# EAGLE design improved sample-and-hold (EAGLE 7.2.0)
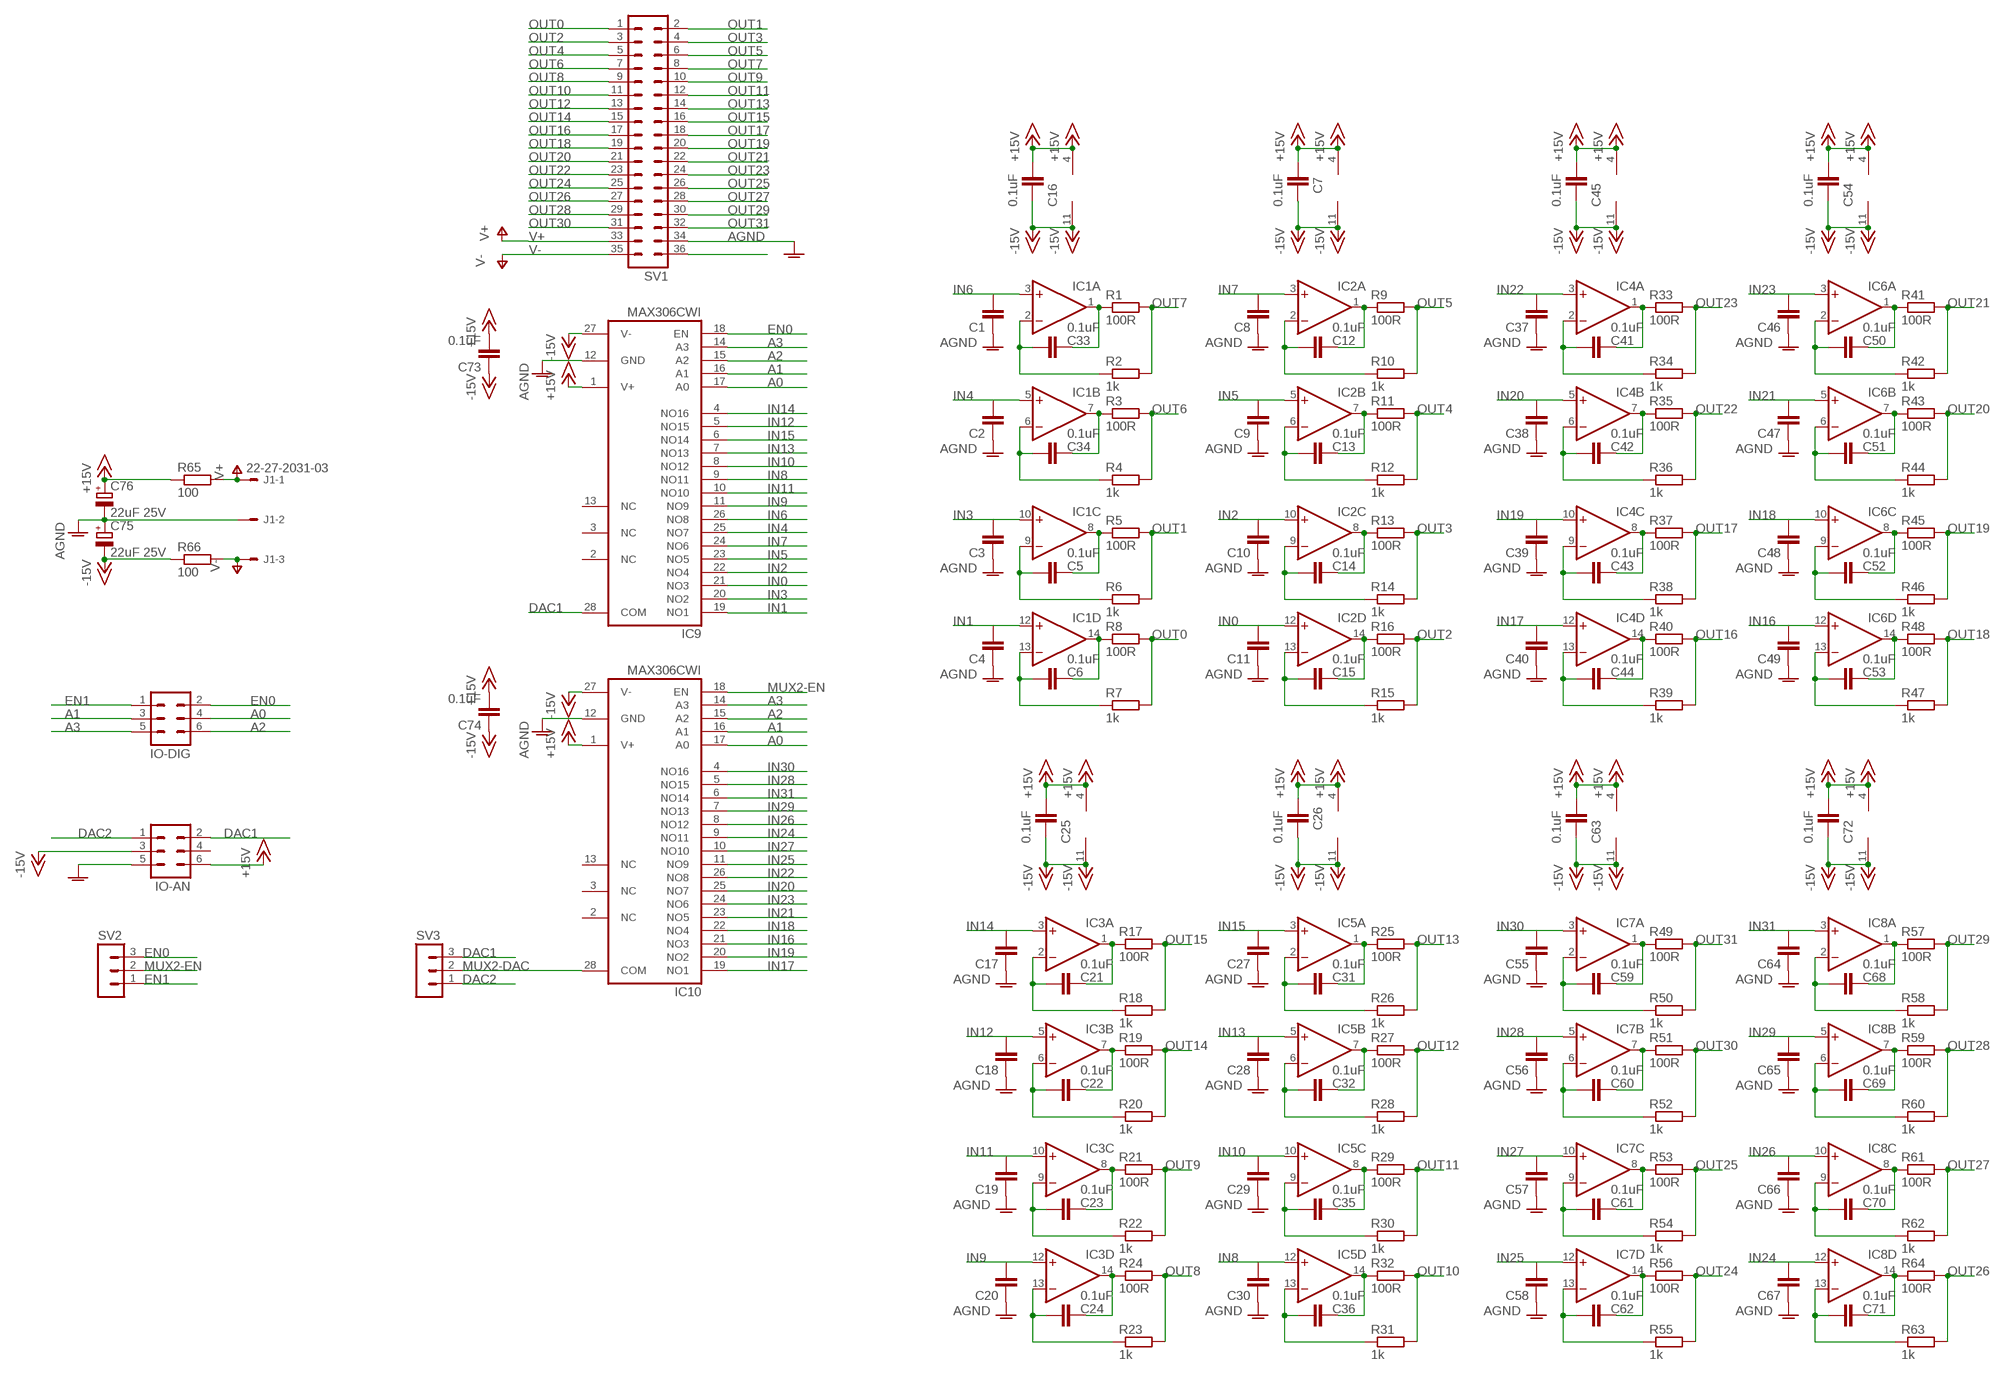
[diagram p0: schematic, sheet 1]

## Parts
C1  C-EUC1206  [C1206]
C2  C-EUC1206  [C1206]
C3  C-EUC1206  [C1206]
C4  C-EUC1206  [C1206]
C5  0.1uF  C-EUC0603  [C0603]
C6  0.1uF  C-EUC0603  [C0603]
C7  0.1uF  C-EUC0603  [C0603]
C8  C-EUC1206  [C1206]
C9  C-EUC1206  [C1206]
C10  C-EUC1206  [C1206]
C11  C-EUC1206  [C1206]
C12  0.1uF  C-EUC0603  [C0603]
C13  0.1uF  C-EUC0603  [C0603]
C14  0.1uF  C-EUC0603  [C0603]
C15  0.1uF  C-EUC0603  [C0603]
C16  0.1uF  C-EUC0603  [C0603]
C17  C-EUC1206  [C1206]
C18  C-EUC1206  [C1206]
C19  C-EUC1206  [C1206]
C20  C-EUC1206  [C1206]
C21  0.1uF  C-EUC0603  [C0603]
C22  0.1uF  C-EUC0603  [C0603]
C23  0.1uF  C-EUC0603  [C0603]
C24  0.1uF  C-EUC0603  [C0603]
C25  0.1uF  C-EUC0603  [C0603]
C26  0.1uF  C-EUC0603  [C0603]
C27  C-EUC1206  [C1206]
C28  C-EUC1206  [C1206]
C29  C-EUC1206  [C1206]
C30  C-EUC1206  [C1206]
C31  0.1uF  C-EUC0603  [C0603]
C32  0.1uF  C-EUC0603  [C0603]
C33  0.1uF  C-EUC0603  [C0603]
C34  0.1uF  C-EUC0603  [C0603]
C35  0.1uF  C-EUC0603  [C0603]
C36  0.1uF  C-EUC0603  [C0603]
C37  C-EUC1206  [C1206]
C38  C-EUC1206  [C1206]
C39  C-EUC1206  [C1206]
C40  C-EUC1206  [C1206]
C41  0.1uF  C-EUC0603  [C0603]
C42  0.1uF  C-EUC0603  [C0603]
C43  0.1uF  C-EUC0603  [C0603]
C44  0.1uF  C-EUC0603  [C0603]
C45  0.1uF  C-EUC0603  [C0603]
C46  C-EUC1206  [C1206]
C47  C-EUC1206  [C1206]
C48  C-EUC1206  [C1206]
C49  C-EUC1206  [C1206]
C50  0.1uF  C-EUC0603  [C0603]
C51  0.1uF  C-EUC0603  [C0603]
C52  0.1uF  C-EUC0603  [C0603]
C53  0.1uF  C-EUC0603  [C0603]
C54  0.1uF  C-EUC0603  [C0603]
C55  C-EUC1206  [C1206]
C56  C-EUC1206  [C1206]
C57  C-EUC1206  [C1206]
C58  C-EUC1206  [C1206]
C59  0.1uF  C-EUC0603  [C0603]
C60  0.1uF  C-EUC0603  [C0603]
C61  0.1uF  C-EUC0603  [C0603]
C62  0.1uF  C-EUC0603  [C0603]
C63  0.1uF  C-EUC0603  [C0603]
C64  C-EUC1206  [C1206]
C65  C-EUC1206  [C1206]
C66  C-EUC1206  [C1206]
C67  C-EUC1206  [C1206]
C68  0.1uF  C-EUC0603  [C0603]
C69  0.1uF  C-EUC0603  [C0603]
C70  0.1uF  C-EUC0603  [C0603]
C71  0.1uF  C-EUC0603  [C0603]
C72  0.1uF  C-EUC0603  [C0603]
C73  0.1uF  C-EUC0603  [C0603]
C74  0.1uF  C-EUC0603  [C0603]
C75  22uF 25V  CPOL-EUE2-5  [E2-5]
C76  22uF 25V  CPOL-EUE2-5  [E2-5]
IC1  TL074D  [SO14]
IC2  TL074D  [SO14]
IC3  TL074D  [SO14]
IC4  TL074D  [SO14]
IC5  TL074D  [SO14]
IC6  TL074D  [SO14]
IC7  TL074D  [SO14]
IC8  TL074D  [SO14]
IC9  MAX306CWI  [SO28L]
IC10  MAX306CWI  [SO28L]
IO-AN  MA03-2  [MA03-2]
IO-DIG  MA03-2  [MA03-2]
J1  22-27-2031-03  [6410-03]
R1  100R  R-EU_R0603  [R0603]
R2  1k  R-EU_R0603  [R0603]
R3  100R  R-EU_R0603  [R0603]
R4  1k  R-EU_R0603  [R0603]
R5  100R  R-EU_R0603  [R0603]
R6  1k  R-EU_R0603  [R0603]
R7  1k  R-EU_R0603  [R0603]
R8  100R  R-EU_R0603  [R0603]
R9  100R  R-EU_R0603  [R0603]
R10  1k  R-EU_R0603  [R0603]
R11  100R  R-EU_R0603  [R0603]
R12  1k  R-EU_R0603  [R0603]
R13  100R  R-EU_R0603  [R0603]
R14  1k  R-EU_R0603  [R0603]
R15  1k  R-EU_R0603  [R0603]
R16  100R  R-EU_R0603  [R0603]
R17  100R  R-EU_R0603  [R0603]
R18  1k  R-EU_R0603  [R0603]
R19  100R  R-EU_R0603  [R0603]
R20  1k  R-EU_R0603  [R0603]
R21  100R  R-EU_R0603  [R0603]
R22  1k  R-EU_R0603  [R0603]
R23  1k  R-EU_R0603  [R0603]
R24  100R  R-EU_R0603  [R0603]
R25  100R  R-EU_R0603  [R0603]
R26  1k  R-EU_R0603  [R0603]
R27  100R  R-EU_R0603  [R0603]
R28  1k  R-EU_R0603  [R0603]
R29  100R  R-EU_R0603  [R0603]
R30  1k  R-EU_R0603  [R0603]
R31  1k  R-EU_R0603  [R0603]
R32  100R  R-EU_R0603  [R0603]
R33  100R  R-EU_R0603  [R0603]
R34  1k  R-EU_R0603  [R0603]
R35  100R  R-EU_R0603  [R0603]
R36  1k  R-EU_R0603  [R0603]
R37  100R  R-EU_R0603  [R0603]
R38  1k  R-EU_R0603  [R0603]
R39  1k  R-EU_R0603  [R0603]
R40  100R  R-EU_R0603  [R0603]
R41  100R  R-EU_R0603  [R0603]
R42  1k  R-EU_R0603  [R0603]
R43  100R  R-EU_R0603  [R0603]
R44  1k  R-EU_R0603  [R0603]
R45  100R  R-EU_R0603  [R0603]
R46  1k  R-EU_R0603  [R0603]
R47  1k  R-EU_R0603  [R0603]
R48  100R  R-EU_R0603  [R0603]
R49  100R  R-EU_R0603  [R0603]
R50  1k  R-EU_R0603  [R0603]
R51  100R  R-EU_R0603  [R0603]
R52  1k  R-EU_R0603  [R0603]
R53  100R  R-EU_R0603  [R0603]
R54  1k  R-EU_R0603  [R0603]
R55  1k  R-EU_R0603  [R0603]
R56  100R  R-EU_R0603  [R0603]
R57  100R  R-EU_R0603  [R0603]
R58  1k  R-EU_R0603  [R0603]
R59  100R  R-EU_R0603  [R0603]
R60  1k  R-EU_R0603  [R0603]
R61  100R  R-EU_R0603  [R0603]
R62  1k  R-EU_R0603  [R0603]
R63  1k  R-EU_R0603  [R0603]
R64  100R  R-EU_R0603  [R0603]
R65  100  R-EU_0207/7  [0207/7]
R66  100  R-EU_0207/7  [0207/7]
SV1  MA18-2  [MA18-2]
SV2  MA03-1  [MA03-1]
SV3  MA03-1  [MA03-1]

## Nets
+15V: C7.1 C16.1 C25.1 C26.1 C45.1 C54.1 C63.1 C72.1 C73.2 C74.2 C76.+ IC1.4(P:V+) IC2.4(P:V+) IC3.4(P:V+) IC4.4(P:V+) IC5.4(P:V+) IC6.4(P:V+) IC7.4(P:V+) IC8.4(P:V+) IC9.1(V+) IC10.1(V+) IO-AN.6 R65.1
-15V: C7.2 C16.2 C25.2 C26.2 C45.2 C54.2 C63.2 C72.2 C73.1 C74.1 C75.- IC1.11(P:V-) IC2.11(P:V-) IC3.11(P:V-) IC4.11(P:V-) IC5.11(P:V-) IC6.11(P:V-) IC7.11(P:V-) IC8.11(P:V-) IC9.27(V-) IC10.27(V-) IO-AN.3 R66.1
A0: IC9.17(A0) IC10.17(A0) IO-DIG.4
A1: IC9.16(A1) IC10.16(A1) IO-DIG.3
A2: IC9.15(A2) IC10.15(A2) IO-DIG.6
A3: IC9.14(A3) IC10.14(A3) IO-DIG.5
AGND: C1.1 C2.1 C3.1 C4.1 C8.1 C9.1 C10.1 C11.1 C17.1 C18.1 C19.1 C20.1 C27.1 C28.1 C29.1 C30.1 C37.1 C38.1 C39.1 C40.1 C46.1 C47.1 C48.1 C49.1 C55.1 C56.1 C57.1 C58.1 C64.1 C65.1 C66.1 C67.1 C75.+ C76.- IC9.12(GND) IC10.12(GND) IO-AN.5 J1.2 SV1.34
DAC1: IC9.28(COM) IO-AN.2 SV3.3
DAC2: IO-AN.1 SV3.1
EN0: IC9.18(EN) IO-DIG.2 SV2.3
EN1: IO-DIG.1 SV2.1
IN0: C11.2 IC2.12(D:+IN) IC9.21(NO3)
IN1: C4.2 IC1.12(D:+IN) IC9.19(NO1)
IN2: C10.2 IC2.10(C:+IN) IC9.22(NO4)
IN3: C3.2 IC1.10(C:+IN) IC9.20(NO2)
IN4: C2.2 IC1.5(B:+IN) IC9.25(NO7)
IN5: C9.2 IC2.5(B:+IN) IC9.23(NO5)
IN6: C1.2 IC1.3(A:+IN) IC9.26(NO8)
IN7: C8.2 IC2.3(A:+IN) IC9.24(NO6)
IN8: C30.2 IC5.12(D:+IN) IC9.9(NO11)
IN9: C20.2 IC3.12(D:+IN) IC9.11(NO9)
IN10: C29.2 IC5.10(C:+IN) IC9.8(NO12)
IN11: C19.2 IC3.10(C:+IN) IC9.10(NO10)
IN12: C18.2 IC3.5(B:+IN) IC9.5(NO15)
IN13: C28.2 IC5.5(B:+IN) IC9.7(NO13)
IN14: C17.2 IC3.3(A:+IN) IC9.4(NO16)
IN15: C27.2 IC5.3(A:+IN) IC9.6(NO14)
IN16: C49.2 IC6.12(D:+IN) IC10.21(NO3)
IN17: C40.2 IC4.12(D:+IN) IC10.19(NO1)
IN18: C48.2 IC6.10(C:+IN) IC10.22(NO4)
IN19: C39.2 IC4.10(C:+IN) IC10.20(NO2)
IN20: C38.2 IC4.5(B:+IN) IC10.25(NO7)
IN21: C47.2 IC6.5(B:+IN) IC10.23(NO5)
IN22: C37.2 IC4.3(A:+IN) IC10.26(NO8)
IN23: C46.2 IC6.3(A:+IN) IC10.24(NO6)
IN24: C67.2 IC8.12(D:+IN) IC10.9(NO11)
IN25: C58.2 IC7.12(D:+IN) IC10.11(NO9)
IN26: C66.2 IC8.10(C:+IN) IC10.8(NO12)
IN27: C57.2 IC7.10(C:+IN) IC10.10(NO10)
IN28: C56.2 IC7.5(B:+IN) IC10.5(NO15)
IN29: C65.2 IC8.5(B:+IN) IC10.7(NO13)
IN30: C55.2 IC7.3(A:+IN) IC10.4(NO16)
IN31: C64.2 IC8.3(A:+IN) IC10.6(NO14)
MUX2-DAC: IC10.28(COM) SV3.2
MUX2-EN: IC10.18(EN) SV2.2
N$1: C33.2 IC1.2(A:-IN) R2.1
N$2: C33.1 IC1.1(A:OUT) R1.1
N$3: C34.1 IC1.7(B:OUT) R3.1
N$4: C5.1 IC1.8(C:OUT) R5.1
N$5: C34.2 IC1.6(B:-IN) R4.1
N$6: C6.1 IC1.14(D:OUT) R8.1
N$7: C5.2 IC1.9(C:-IN) R6.1
N$8: C6.2 IC1.13(D:-IN) R7.1
N$9: C21.1 IC3.1(A:OUT) R17.1
N$10: C21.2 IC3.2(A:-IN) R18.1
N$11: C12.1 IC2.1(A:OUT) R9.1
N$12: C12.2 IC2.2(A:-IN) R10.1
N$13: C13.1 IC2.7(B:OUT) R11.1
N$14: C13.2 IC2.6(B:-IN) R12.1
N$15: C14.1 IC2.8(C:OUT) R13.1
N$16: C15.1 IC2.14(D:OUT) R16.1
N$17: C14.2 IC2.9(C:-IN) R14.1
N$18: C15.2 IC2.13(D:-IN) R15.1
N$19: C22.1 IC3.7(B:OUT) R19.1
N$20: C22.2 IC3.6(B:-IN) R20.1
N$21: C23.1 IC3.8(C:OUT) R21.1
N$22: C24.1 IC3.14(D:OUT) R24.1
N$23: C23.2 IC3.9(C:-IN) R22.1
N$24: C24.2 IC3.13(D:-IN) R23.1
N$25: C31.1 IC5.1(A:OUT) R25.1
N$26: C31.2 IC5.2(A:-IN) R26.1
N$27: C32.1 IC5.7(B:OUT) R27.1
N$28: C32.2 IC5.6(B:-IN) R28.1
N$29: C35.1 IC5.8(C:OUT) R29.1
N$30: C36.1 IC5.14(D:OUT) R32.1
N$31: C35.2 IC5.9(C:-IN) R30.1
N$32: C36.2 IC5.13(D:-IN) R31.1
N$33: C41.1 IC4.1(A:OUT) R33.1
N$34: C41.2 IC4.2(A:-IN) R34.1
N$35: C42.1 IC4.7(B:OUT) R35.1
N$36: C42.2 IC4.6(B:-IN) R36.1
N$37: C43.1 IC4.8(C:OUT) R37.1
N$38: C44.1 IC4.14(D:OUT) R40.1
N$39: C43.2 IC4.9(C:-IN) R38.1
N$40: C44.2 IC4.13(D:-IN) R39.1
N$41: C50.1 IC6.1(A:OUT) R41.1
N$42: C50.2 IC6.2(A:-IN) R42.1
N$43: C51.1 IC6.7(B:OUT) R43.1
N$44: C51.2 IC6.6(B:-IN) R44.1
N$45: C52.1 IC6.8(C:OUT) R45.1
N$46: C53.1 IC6.14(D:OUT) R48.1
N$47: C52.2 IC6.9(C:-IN) R46.1
N$48: C53.2 IC6.13(D:-IN) R47.1
N$49: C59.1 IC7.1(A:OUT) R49.1
N$50: C59.2 IC7.2(A:-IN) R50.1
N$51: C60.1 IC7.7(B:OUT) R51.1
N$52: C60.2 IC7.6(B:-IN) R52.1
N$53: C61.1 IC7.8(C:OUT) R53.1
N$54: C62.1 IC7.14(D:OUT) R56.1
N$55: C61.2 IC7.9(C:-IN) R54.1
N$56: C62.2 IC7.13(D:-IN) R55.1
N$57: C68.1 IC8.1(A:OUT) R57.1
N$58: C68.2 IC8.2(A:-IN) R58.1
N$59: C69.1 IC8.7(B:OUT) R59.1
N$60: C69.2 IC8.6(B:-IN) R60.1
N$61: C70.1 IC8.8(C:OUT) R61.1
N$62: C71.1 IC8.14(D:OUT) R64.1
N$63: C70.2 IC8.9(C:-IN) R62.1
N$64: C71.2 IC8.13(D:-IN) R63.1
N$65: SV1.36
OUT0: R7.2 R8.2 SV1.1
OUT1: R5.2 R6.2 SV1.2
OUT2: R15.2 R16.2 SV1.3
OUT3: R13.2 R14.2 SV1.4
OUT4: R11.2 R12.2 SV1.5
OUT5: R9.2 R10.2 SV1.6
OUT6: R3.2 R4.2 SV1.7
OUT7: R1.2 R2.2 SV1.8
OUT8: R23.2 R24.2 SV1.9
OUT9: R21.2 R22.2 SV1.10
OUT10: R31.2 R32.2 SV1.11
OUT11: R29.2 R30.2 SV1.12
OUT12: R27.2 R28.2 SV1.13
OUT13: R25.2 R26.2 SV1.14
OUT14: R19.2 R20.2 SV1.15
OUT15: R17.2 R18.2 SV1.16
OUT16: R39.2 R40.2 SV1.17
OUT17: R37.2 R38.2 SV1.18
OUT18: R47.2 R48.2 SV1.19
OUT19: R45.2 R46.2 SV1.20
OUT20: R43.2 R44.2 SV1.21
OUT21: R41.2 R42.2 SV1.22
OUT22: R35.2 R36.2 SV1.23
OUT23: R33.2 R34.2 SV1.24
OUT24: R55.2 R56.2 SV1.25
OUT25: R53.2 R54.2 SV1.26
OUT26: R63.2 R64.2 SV1.27
OUT27: R61.2 R62.2 SV1.28
OUT28: R59.2 R60.2 SV1.29
OUT29: R57.2 R58.2 SV1.30
OUT30: R51.2 R52.2 SV1.31
OUT31: R49.2 R50.2 SV1.32
V+: J1.1 R65.2 SV1.33
V-: J1.3 R66.2 SV1.35
Unconnected: IC9.2(NC) IC9.3(NC) IC9.13(NC) IC10.2(NC) IC10.3(NC) IC10.13(NC) IO-AN.4

## Library data of the parts
C1-C74 = resistor:C-EU: CAPACITOR, European symbol
C75 C76 = resistor:CPOL-EU: POLARIZED CAPACITOR, European symbol
IC1-IC8 = linear:TL074: OP AMP
IC9 IC10 = maxim:MAX306CWI: MULTIPLEXER; MF: MAXIM; MPN: MAX306CWI; OC_FARNELL: unknown; OC_NEWARK: 90C2555
IO-AN IO-DIG = con-lstb:MA03-2: PIN HEADER; OC_FARNELL: unknown; OC_NEWARK: unknown
J1 = con-molex:22-?-03: CONNECTOR wire to board 2.54 mm (.1 inch) pitch header; OC_FARNELL: unknown; OC_NEWARK: unknown
R1-R66 = resistor:R-EU_: RESISTOR, European symbol
SV1 = con-lstb:MA18-2: PIN HEADER; OC_FARNELL: unknown; OC_NEWARK: unknown
SV2 SV3 = joakim:MA03-1: PIN HEADER; OC_FARNELL: unknown; OC_NEWARK: unknown

## Board
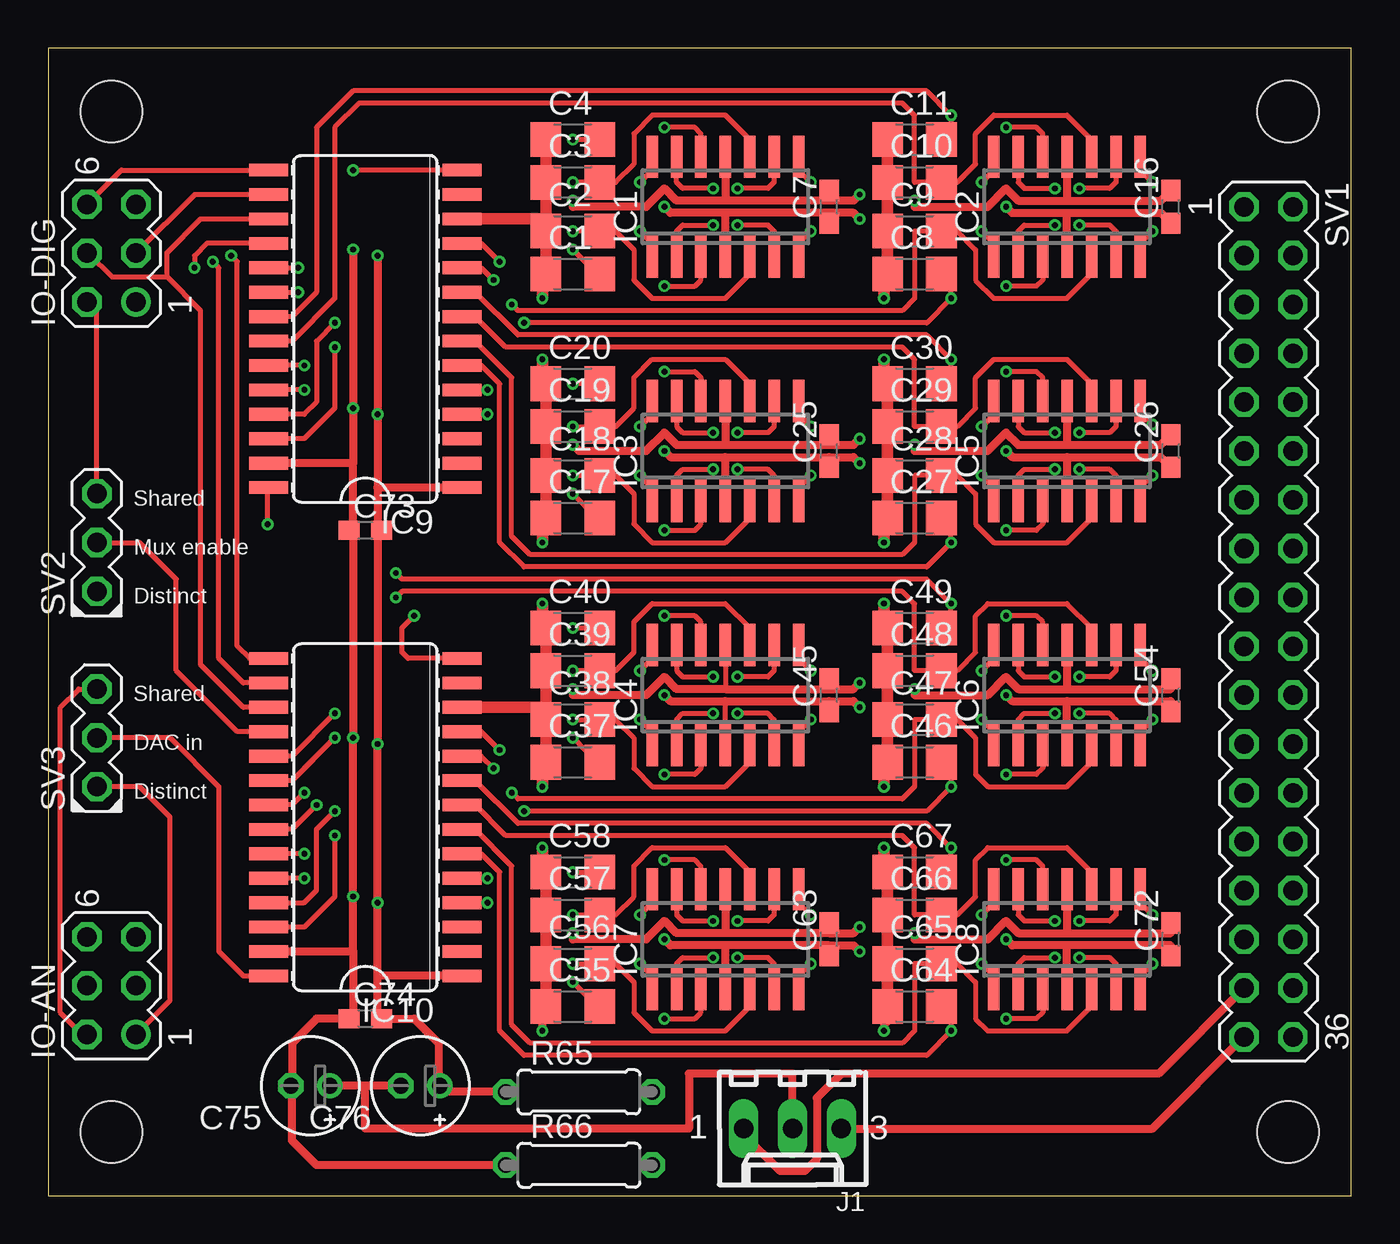
[diagram p1: board, top side]
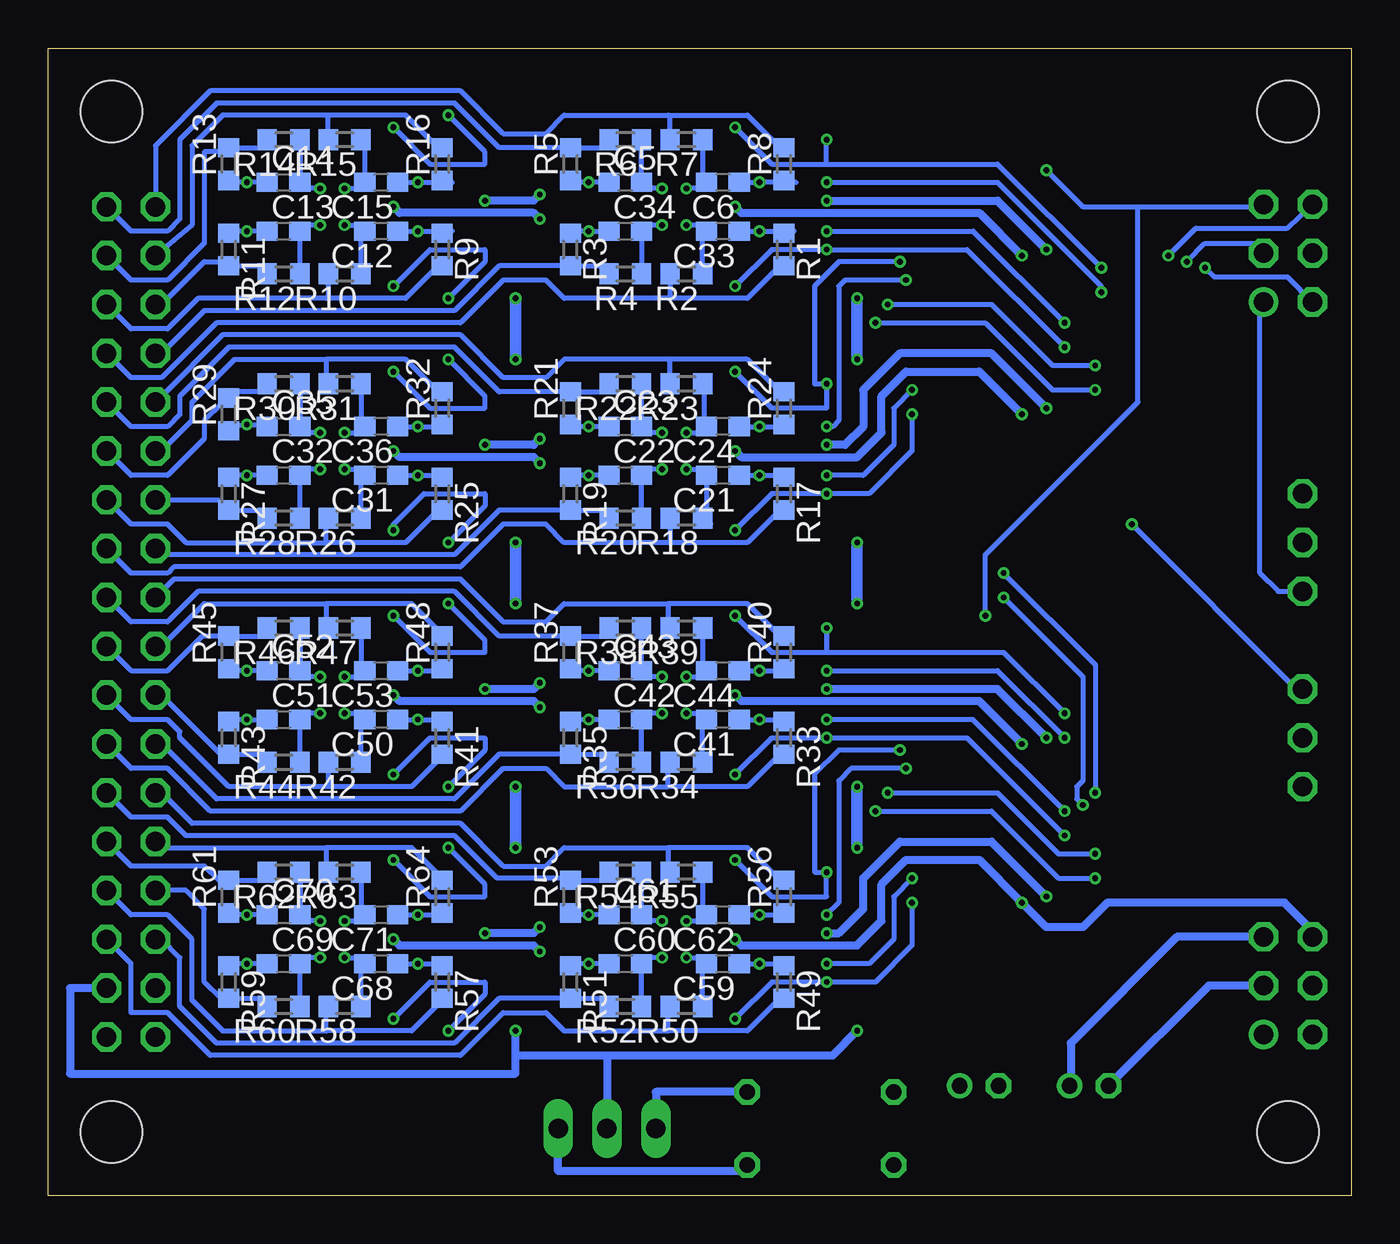
[diagram p2: board, bottom side, seen from below]

Size 67.82 x 59.69 mm. Coordinates in mm from the lower left corner, seen from the top.
Outline: 0,0 67.82,0 67.82,59.69 0,59.69 0,0
Copper layers (1*16): Top 0.035mm / dielectric 1.5mm / Bottom 0.035mm
Design rules "dirt_cheap_dirty_boards.v1": minimum track width 5mil, minimum drill 12mil, track to track 5mil, track to pad 5mil, pad to pad 5mil, via to via 5mil, smd to smd 0mil, copper to edge 10mil, drill to drill 10mil, minimum pad ring 10mil, minimum via ring 6mil, stop-mask expansion 2mil, vias tented up to drill 25mil, thermal gap 10mil
Holes 3.2 mm at 3.3,56.39 64.52,56.39 64.52,3.3 3.3,3.3

### Footprints (pad centres in the part's own frame; a part is rotated, then mirrored left to right if it is on the bottom)
C1206 = smd 1.6 x 1.8: 1 -1.4,0; 2 1.4,0
C0603 = smd 1.1 x 1: 1 -0.85,0; 2 0.85,0
E2-5 = drill 0.813 pad 1.27: + -1.016,0 | drill 0.813 pad 1.27 octagon: - 1.016,0
SO14 = smd 0.6 x 2.2: 1 -3.81,-2.6; 2 -2.54,-2.6; 3 -1.27,-2.6; 4 0,-2.6; 5 1.27,-2.6; 6 2.54,-2.6; 7 3.81,-2.6; 8 3.81,2.6; 9 2.54,2.6; 10 1.27,2.6; 11 0,2.6; 12 -1.27,2.6; 13 -2.54,2.6; 14 -3.81,2.6
SO28L = smd 0.66 x 2.032: 1 -8.255,-5.029; 2 -6.985,-5.029; 3 -5.715,-5.029; 4 -4.445,-5.029; 5 -3.175,-5.029; 6 -1.905,-5.029; 7 -0.635,-5.029; 8 0.635,-5.029; 9 1.905,-5.029; 10 3.175,-5.029; 11 4.445,-5.029; 12 5.715,-5.029; 13 6.985,-5.029; 14 8.255,-5.029; 15 8.255,5.029; 16 6.985,5.029; 17 5.715,5.029; 18 4.445,5.029; 19 3.175,5.029; 20 1.905,5.029; 21 0.635,5.029; 22 -0.635,5.029; 23 -1.905,5.029; 24 -3.175,5.029; 25 -4.445,5.029; 26 -5.715,5.029; 27 -6.985,5.029; 28 -8.255,5.029
MA03-2 = drill 1.016: 1 -2.54,-1.27 | drill 1.016 octagon: 2 -2.54,1.27; 3 0,-1.27; 4 0,1.27; 5 2.54,-1.27; 6 2.54,1.27
6410-03 = drill 1.016 long: 1 2.54,0; 2 0,0; 3 -2.54,0
R0603 = smd 1 x 1.1: 1 -0.85,0; 2 0.85,0
0207/7 = drill 0.813 octagon: 1 -3.81,0; 2 3.81,0
MA18-2 = drill 1.016 octagon: 1 -21.59,-1.27; 2 -21.59,1.27; 3 -19.05,-1.27; 4 -19.05,1.27; 5 -16.51,-1.27; 6 -16.51,1.27; 7 -13.97,-1.27; 8 -13.97,1.27; 9 -11.43,-1.27; 10 -11.43,1.27; 11 -8.89,-1.27; 12 -8.89,1.27; 13 -6.35,-1.27; 14 -6.35,1.27; 15 -3.81,-1.27; 16 -3.81,1.27; 17 -1.27,-1.27; 18 -1.27,1.27; 19 1.27,-1.27; 20 1.27,1.27; 21 3.81,-1.27; 22 3.81,1.27; 23 6.35,-1.27; 24 6.35,1.27; 25 8.89,-1.27; 26 8.89,1.27; 27 11.43,-1.27; 28 11.43,1.27; 29 13.97,-1.27; 30 13.97,1.27; 31 16.51,-1.27; 32 16.51,1.27; 33 19.05,-1.27; 34 19.05,1.27; 35 21.59,-1.27; 36 21.59,1.27
MA03-1 = drill 1.016 octagon: 1 -2.54,0; 2 0,0; 3 2.54,0

### Placement (x,y rotation side)
C1  27.3,47.94 0 top
C2  27.3,50.16 0 top
C3  27.3,52.7 0 top
C4  27.3,54.93 0 top
C5  37.78,52.7 0 bottom
C6  32.7,52.7 180 bottom
C7  40.64,51.44 90 top
C8  45.09,47.94 0 top
C9  45.09,50.16 0 top
C10  45.09,52.7 0 top
C11  45.09,54.93 0 top
C12  50.48,50.16 180 bottom
C13  55.56,50.16 0 bottom
C14  55.56,52.7 0 bottom
C15  50.48,52.7 180 bottom
C16  58.42,51.44 90 top
C17  27.3,35.24 0 top
C18  27.3,37.47 0 top
C19  27.3,40.01 0 top
C20  27.3,42.23 0 top
C21  32.7,37.47 180 bottom
C22  37.78,37.47 0 bottom
C23  37.78,40.01 0 bottom
C24  32.7,40.01 180 bottom
C25  40.64,38.73 90 top
C26  58.42,38.73 90 top
C27  45.09,35.24 0 top
C28  45.09,37.47 0 top
C29  45.09,40.01 0 top
C30  45.09,42.23 0 top
C31  50.48,37.47 180 bottom
C32  55.56,37.47 0 bottom
C33  32.7,50.16 180 bottom
C34  37.78,50.16 0 bottom
C35  55.56,40.01 0 bottom
C36  50.48,40.01 180 bottom
C37  27.3,22.54 0 top
C38  27.3,24.77 0 top
C39  27.3,27.3 0 top
C40  27.3,29.53 0 top
C41  32.7,24.77 180 bottom
C42  37.78,24.77 0 bottom
C43  37.78,27.3 0 bottom
C44  32.7,27.3 180 bottom
C45  40.64,26.04 90 top
C46  45.09,22.54 0 top
C47  45.09,24.77 0 top
C48  45.09,27.3 0 top
C49  45.09,29.53 0 top
C50  50.48,24.77 180 bottom
C51  55.56,24.77 0 bottom
C52  55.56,27.3 0 bottom
C53  50.48,27.3 180 bottom
C54  58.42,26.04 90 top
C55  27.3,9.84 0 top
C56  27.3,12.06 0 top
C57  27.3,14.61 0 top
C58  27.3,16.83 0 top
C59  32.7,12.06 180 bottom
C60  37.78,12.06 0 bottom
C61  37.78,14.61 0 bottom
C62  32.7,14.61 180 bottom
C63  40.64,13.34 90 top
C64  45.09,9.84 0 top
C65  45.09,12.06 0 top
C66  45.09,14.61 0 top
C67  45.09,16.83 0 top
C68  50.48,12.06 180 bottom
C69  55.56,12.06 0 bottom
C70  55.56,14.61 0 bottom
C71  50.48,14.61 180 bottom
C72  58.42,13.34 90 top
C73  16.51,34.61 0 top
C74  16.51,9.21 0 top
C75  13.65,5.71 180 top
C76  19.37,5.71 180 top
IC1  35.24,51.44 0 top
IC2  53.02,51.44 0 top
IC3  35.24,38.73 0 top
IC4  35.24,26.04 0 top
IC5  53.02,38.73 0 top
IC6  53.02,26.04 0 top
IC7  35.24,13.34 0 top
IC8  53.02,13.34 0 top
IC9  16.51,45.09 90 top
IC10  16.51,19.68 90 top
IO-AN  3.3,10.92 90 top
IO-DIG  3.3,49.02 90 top
J1  38.73,3.49 180 top
R1  29.53,49.21 270 bottom
R2  34.61,47.94 180 bottom
R3  40.64,49.21 270 bottom
R4  37.78,47.94 180 bottom
R5  40.64,53.66 90 bottom
R6  37.78,54.93 180 bottom
R7  34.61,54.93 180 bottom
R8  29.53,53.66 90 bottom
R9  47.31,49.21 270 bottom
R10  52.39,47.94 180 bottom
R11  58.42,49.21 270 bottom
R12  55.56,47.94 180 bottom
R13  58.42,53.66 90 bottom
R14  55.56,54.93 180 bottom
R15  52.39,54.93 180 bottom
R16  47.31,53.66 90 bottom
R17  29.53,36.51 270 bottom
R18  34.61,35.24 180 bottom
R19  40.64,36.51 270 bottom
R20  37.78,35.24 180 bottom
R21  40.64,40.96 90 bottom
R22  37.78,42.23 180 bottom
R23  34.61,42.23 180 bottom
R24  29.53,40.96 90 bottom
R25  47.31,36.51 270 bottom
R26  52.39,35.24 180 bottom
R27  58.42,36.51 270 bottom
R28  55.56,35.24 180 bottom
R29  58.42,40.64 90 bottom
R30  55.56,42.23 180 bottom
R31  52.39,42.23 180 bottom
R32  47.31,40.96 90 bottom
R33  29.53,23.81 270 bottom
R34  34.61,22.54 180 bottom
R35  40.64,23.81 270 bottom
R36  37.78,22.54 180 bottom
R37  40.64,28.26 90 bottom
R38  37.78,29.53 180 bottom
R39  34.61,29.53 180 bottom
R40  29.53,28.26 90 bottom
R41  47.31,23.81 270 bottom
R42  52.39,22.54 180 bottom
R43  58.42,23.81 270 bottom
R44  55.56,22.54 180 bottom
R45  58.42,28.26 90 bottom
R46  55.56,29.53 180 bottom
R47  52.39,29.53 180 bottom
R48  47.31,28.26 90 bottom
R49  29.53,11.11 270 bottom
R50  34.61,9.84 180 bottom
R51  40.64,11.11 270 bottom
R52  37.78,9.84 180 bottom
R53  40.64,15.56 90 bottom
R54  37.78,16.83 180 bottom
R55  34.61,16.83 180 bottom
R56  29.53,15.56 90 bottom
R57  47.31,11.11 270 bottom
R58  52.39,9.84 180 bottom
R59  58.42,11.11 270 bottom
R60  55.56,9.84 180 bottom
R61  58.42,15.56 90 bottom
R62  55.56,16.83 180 bottom
R63  52.39,16.83 180 bottom
R64  47.31,15.56 90 bottom
R65  27.62,5.4 0 top
R66  27.62,1.59 0 top
SV1  63.5,29.84 270 top
SV2  2.54,33.97 90 top
SV3  2.54,23.81 90 top

### Tracks (layer width: path | path; a pad name or v marks a point on that pad's centre or on a via)
+15V  (via drill 0.3)
  Top 0.254: IC4.4 35.24,25.72 | 40.64,13.02 C63.1
  Top 0.406: 17.14,36.83 v17.14,40.64 v17.14,48.9 | 17.14,36.83 17.14,34.82 C73.2 17.14,34.61 v17.14,23.5 v17.14,15.24 17.14,11.43 | IC9.1 17.14,36.83 | IC3.4 35.24,38.42 | v32.07,38.73 32.38,38.42 35.24,38.42 | 35.24,38.42 40.64,38.42 | v42.23,50.8 41.91,51.12 40.64,51.12 | C7.1 40.64,51.12 | 40.64,51.12 35.24,51.12 | 35.24,51.12 32.38,51.12 v32.07,51.44 | IC1.4 35.24,51.12 | v49.85,51.44 50.16,51.12 53.02,51.12 | 53.02,51.12 57.89,51.12 C16.1 | IC2.4 53.02,51.12 | C25.1 40.64,38.42 | 40.64,38.42 41.91,38.42 v42.23,38.1 | v49.85,38.73 50.16,38.42 53.02,38.42 | 53.02,38.42 57.89,38.42 C26.1 | 53.02,38.42 IC5.4 | C74.2 17.14,9.21 17.14,9.42 | v32.07,26.04 32.38,25.72 35.24,25.72 40.64,25.72 | 35.24,13.02 40.64,13.02 41.91,13.02 v42.23,12.7 | 35.24,13.02 32.38,13.02 v32.07,13.34 | 17.14,9.42 C74.2 | 17.14,9.42 17.14,11.43 | C72.1 58.42,13.02 53.02,13.02 | 53.02,13.02 50.16,13.02 v49.85,13.34 | IC8.4 53.02,13.02 | 40.64,25.72 41.91,25.72 v42.23,25.4 | 40.64,25.08 C45.1 40.64,25.72 | v49.85,26.04 50.16,25.72 53.02,25.72 | 53.02,25.72 58.42,25.72 C54.1 | IC6.4 53.02,25.72 | IC10.1 17.14,11.43 | C74.2 19.05,9.21 20.32,7.94 20.32,5.78 C76.+ 20.7,5.4 R65.1 | IC7.4 35.24,13.02
  Bottom 0.406: v32.07,38.73 31.75,38.42 25.72,38.42 24.45,39.69 24.45,41.59 23.18,42.86 19.37,42.86 v17.14,40.64 | v32.07,51.44 31.75,51.12 19.37,51.12 v17.14,48.9 | v42.23,50.8 42.55,51.12 49.53,51.12 v49.85,51.44 | v42.23,38.1 42.55,38.42 49.53,38.42 v49.85,38.73 | v17.14,23.5 19.37,25.72 31.75,25.72 v32.07,26.04 | v32.07,13.34 31.75,13.02 25.72,13.02 24.45,14.29 24.45,16.19 23.18,17.46 19.37,17.46 v17.14,15.24 15.88,13.97 13.97,13.97 12.7,15.24 3.49,15.24 2.03,13.78 IO-AN.6 | v49.85,13.34 49.53,13.02 42.55,13.02 v42.23,12.7 | v42.23,25.4 42.55,25.72 49.53,25.72 v49.85,26.04
-15V  (via drill 0.3)
  Top 0.254: C25.2 40.64,39.05 40.96,39.05 | IC4.11 35.24,26.35 | 40.64,13.65 C63.2 | C72.2 58.42,13.65
  Top 0.406: 15.56,34.61 15.88,34.61 | 15.88,34.61 15.88,38.1 | 15.88,38.1 IC9.27 | 15.88,38.1 v15.88,40.96 v15.88,49.21 | v27.3,39.05 27.62,38.73 31.11,38.73 32.07,39.69 32.7,39.05 35.24,39.05 | 35.24,39.05 40.96,39.05 41.91,39.05 v42.23,39.37 | IC3.11 35.24,39.05 | v42.23,52.07 41.91,51.75 40.64,51.75 | C7.2 40.64,51.75 | 40.64,51.75 35.24,51.75 | 35.24,51.75 32.7,51.75 32.07,52.39 31.11,51.44 27.3,51.44 v27.3,51.75 | IC1.11 35.24,51.75 | v45.09,51.75 45.09,51.44 48.9,51.44 49.85,52.39 50.48,51.75 53.02,51.75 | 53.02,51.75 57.89,51.75 C16.2 | IC2.11 53.02,51.75 | v45.09,39.05 45.09,38.73 48.9,38.73 49.85,39.69 50.48,39.05 53.02,39.05 | 53.02,39.05 57.89,39.05 C26.2 | IC5.11 53.02,39.05 | IC10.27 15.88,12.7 | 15.88,12.7 v15.88,15.56 v15.88,23.81 15.88,34.61 | 15.88,12.7 15.88,9.42 C74.1 13.97,9.21 12.7,7.94 12.7,5.78 | v27.3,26.35 27.3,26.04 31.11,26.04 32.07,26.99 32.7,26.35 35.24,26.35 40.64,26.35 | 35.24,13.65 40.64,13.65 41.91,13.65 v42.23,13.97 | 35.24,13.65 32.7,13.65 32.07,14.29 31.11,13.34 27.3,13.34 v27.3,13.65 | v45.09,13.65 45.09,13.34 48.9,13.34 49.85,14.29 50.48,13.65 53.02,13.65 | IC8.11 53.02,13.65 | 53.02,13.65 58.42,13.65 | 40.64,26.35 41.91,26.35 v42.23,26.67 | C45.2 40.64,26.35 | v45.09,26.35 45.09,26.04 48.9,26.04 49.85,26.99 50.48,26.35 53.02,26.35 | 53.02,26.35 58.42,26.35 C54.2 | IC6.11 53.02,26.35 | 12.7,5.78 C75.- | R66.1 13.97,1.59 12.7,2.86 12.7,5.78 | IC7.11 35.24,13.65
  Top 0.61: 15.56,34.61 C73.1
  Bottom 0.406: v15.88,40.96 18.73,43.81 23.5,43.81 25.4,41.91 25.4,40.01 26.35,39.05 v27.3,39.05 | v27.3,51.75 18.41,51.75 v15.88,49.21 | v42.23,52.07 42.55,51.75 v45.09,51.75 | v42.23,39.37 42.55,39.05 v45.09,39.05 | v15.88,23.81 18.41,26.35 v27.3,26.35 | v27.3,13.65 26.67,13.65 25.4,14.92 25.4,16.51 23.5,18.41 18.73,18.41 v15.88,15.56 | v42.23,13.97 42.55,13.65 v45.09,13.65 | v42.23,26.67 42.55,26.35 v45.09,26.35 | IO-AN.3 7.43,10.92 C75.-
A0
  Top 0.254: IO-DIG.4 2.1,49.02 3.33,47.78 6.19,47.78 | IC9.17 7.94,50.8 6.19,49.05 6.19,47.78 | IC10.17 10.16,25.4 7.94,27.62 7.94,46.04 6.19,47.78
A1  (via drill 0.3)
  Top 0.254: IC10.16 10.16,26.67 8.89,27.94 8.89,48.26 v8.57,48.58 | IC9.16 7.62,52.07 IO-DIG.3
  Bottom 0.254: v8.57,48.58 7.62,49.53 5.08,49.53 4.76,49.21 4.7,48.9 IO-DIG.3
A2  (via drill 0.3)
  Top 0.254: IO-DIG.6 3.81,53.34 IC9.15 | IC10.15 10.48,27.94 9.84,28.57 9.84,48.58 v9.53,48.9
  Bottom 0.254: v9.53,48.9 8.1,50.32 3.33,50.32 IO-DIG.6
A3  (via drill 0.3)
  Top 0.254: IC9.14 v15.88,53.34 | IC10.14 18.73,27.94 18.41,28.26 18.41,29.53 v19.05,30.16
  Bottom 0.254: v15.88,53.34 13.97,51.44 11.11,51.44 | 11.11,51.44 4.7,51.44 IO-DIG.5 | v19.05,30.16 19.05,33.34 11.11,41.27 11.11,51.44
AGND  (via drill 0.3)
  Top 0.254: 25.91,50.8 C2.1 | C10.1 43.81,52.7 | C27.1 43.81,35.11 | C20.1 25.91,42.86 25.72,42.86 | 25.72,47.94 C1.1
  Top 0.406: C64.1 43.69,9.08 43.5,8.89 v43.5,8.57 | v25.72,8.57 25.72,9.65 C55.1 | C76.- 16.51,5.71 | 16.51,5.71 C75.+ | J1.2 38.73,6.35 33.34,6.35 33.34,3.49 16.51,3.49 16.51,5.71
  Top 0.61: IC9.12 25.91,50.8 | C4.1 C3.1 C2.1 C1.1 | C20.1 C19.1 C18.1 C17.1 25.91,35.11 25.72,34.92 v25.72,33.97 | 25.72,47.94 v25.72,46.67 | 25.72,42.86 v25.72,43.5 | v25.72,30.8 25.72,29.71 C40.1 C39.1 25.91,25.4 | C55.1 C56.1 C57.1 C58.1 25.91,16.96 25.72,17.14 v25.72,18.1 | v25.72,21.27 25.72,22.36 C37.1 C38.1 25.91,25.4 | C11.1 C10.1 C9.1 C8.1 43.69,47.49 43.5,47.31 v43.5,46.67 | v43.5,43.5 43.5,42.41 C30.1 C29.1 C28.1 C27.1 | 43.81,35.11 43.81,34.92 43.5,34.61 v43.5,33.97 | v43.5,30.8 43.5,29.71 C49.1 C48.1 C47.1 C46.1 43.69,22.41 43.5,22.23 v43.5,21.27 | v43.5,18.1 43.5,17.02 C67.1 C66.1 C65.1 C64.1 | IC10.12 25.91,25.4
  Bottom 0.406: 38.73,7.3 26.99,7.3 v25.72,8.57 | 43.5,7.3 38.73,7.3 | 38.73,7.3 J1.2 | IO-AN.5 9.08,13.46 14.61,7.94 14.61,5.78 C75.+ | SV1.34 66.67,10.79 66.67,6.35 43.5,6.35 43.5,7.3 | 43.5,7.3 v43.5,8.57
  Bottom 0.61: v25.72,43.5 v25.72,46.67 | v25.72,33.97 v25.72,30.8 | v25.72,18.1 v25.72,21.27 | v43.5,33.97 v43.5,30.8 | v43.5,21.27 v43.5,18.1 | v43.5,46.67 v43.5,43.5
DAC1  (via drill 0.3)
  Top 0.254: v11.43,34.92 11.43,36.78 IC9.28 | IO-AN.2 1.78,8.38 0.64,9.53 0.64,25.4 1.59,26.35 SV3.3
  Bottom 0.254: v11.43,34.92 2.86,26.35 SV3.3
DAC2
  Top 0.254: IO-AN.1 6.35,10.16 6.35,19.68 4.76,21.27 SV3.1
EN0  (via drill 0.3)
  Top 0.254: IO-DIG.2 2.54,46.04 SV2.3 | IC9.18 8.26,49.53 7.62,48.9 v7.62,48.26
  Bottom 0.254: v7.62,48.26 7.14,47.78 3.33,47.78 IO-DIG.2
EN1
  Bottom 0.254: IO-DIG.1 4.76,46.29 4.76,32.38 3.81,31.43 SV2.1
IN0  (via drill 0.3)
  Top 0.254: IC2.12 51.75,55.24 51.44,55.56 v49.85,55.56 | C11.2 46.99,54.93 v46.99,56.2 45.72,57.47 15.88,57.47 13.97,55.56 13.97,46.99 12.7,45.72 IC9.21
  Bottom 0.254: v49.85,55.56 47.94,53.66 45.09,53.66 45.09,54.29 v46.99,56.2
IN1  (via drill 0.3)
  Top 0.254: C4.2 v27.3,54.93 | IC1.12 33.97,55.24 33.66,55.56 v32.07,55.56 | IC9.19 v13.02,48.26
  Bottom 0.254: 27.3,53.66 18.41,53.66 v13.02,48.26 | v32.07,55.56 30.16,53.66 27.3,53.66 | 27.3,53.66 v27.3,54.93
IN2
  Top 0.254: IC2.10 54.29,54.93 53.02,56.2 49.21,56.2 48.26,55.24 48.26,53.66 47.31,52.7 C10.2 46.48,52.84 46.35,52.7 45.09,52.7 45.09,56.2 44.45,56.83 16.19,56.83 14.92,55.56 14.92,46.67 12.7,44.45 IC9.22
IN3  (via drill 0.3)
  Top 0.254: v27.3,52.7 C3.2 29.53,52.7 30.48,53.66 30.48,55.24 31.43,56.2 35.24,56.2 36.51,54.93 IC1.10 | IC9.20 v13.02,46.99
  Bottom 0.254: v27.3,52.7 18.41,52.7 13.02,47.31 v13.02,46.99
IN4  (via drill 0.3)
  Top 0.254: v27.3,50.16 C2.2 28.7,50.03 28.57,50.16 29.53,50.16 30.48,49.21 30.48,47.62 31.43,46.67 35.24,46.67 36.51,47.94 IC1.5 | v14.92,45.4 13.97,44.45 13.97,41.27 13.34,40.64 IC9.25
  Bottom 0.254: v27.3,50.16 19.68,50.16 v14.92,45.4
IN5  (via drill 0.3)
  Top 0.254: IC2.5 54.29,47.94 53.02,46.67 49.21,46.67 48.26,47.62 48.26,49.21 47.31,50.16 C9.2 46.48,50.03 46.35,50.16 45.09,50.16 45.09,46.67 44.45,46.04 24.45,46.04 v24.13,46.35 | v13.34,43.18 IC9.23
  Bottom 0.254: v24.13,46.35 18.73,46.35 15.56,43.18 v13.34,43.18
IN6  (via drill 0.3)
  Top 0.254: C1.2 28.57,47.94 v27.3,49.21 | v32.07,47.31 33.66,47.31 33.97,47.62 IC1.3 | v14.92,44.13 14.92,40.96 13.34,39.37 IC9.26
  Bottom 0.254: v32.07,47.31 30.16,49.21 v27.3,49.21 20,49.21 v14.92,44.13
IN7  (via drill 0.3)
  Top 0.254: IC2.3 51.75,47.62 51.44,47.31 v49.85,47.31 | C8.2 46.35,47.62 46.99,47.31 v46.99,46.67 45.72,45.4 v24.77,45.4 | v13.34,41.91 IC9.24
  Bottom 0.254: v49.85,47.31 47.94,49.21 45.09,49.21 45.09,48.58 v46.99,46.67 | v24.77,45.4 19.05,45.4 15.56,41.91 v13.34,41.91
IN8  (via drill 0.3)
  Top 0.254: IC5.12 51.75,42.55 51.44,42.86 v49.85,42.86 | 46.35,42.36 C30.2 46.67,42.23 46.99,42.55 v46.99,43.5 45.72,44.77 24.45,44.77 22.23,46.99 IC9.9
  Bottom 0.254: v49.85,42.86 47.94,40.96 45.09,40.96 45.09,41.59 v46.99,43.5
IN9  (via drill 0.3)
  Top 0.254: C20.2 v27.3,42.23 | v32.07,42.86 33.66,42.86 33.97,42.55 IC3.12 | IC9.11 22.54,49.53 v23.5,48.58
  Bottom 0.254: v32.07,42.86 30.16,40.96 27.3,40.96 v27.3,42.23 27.94,42.23 27.94,47.31 26.67,48.58 v23.5,48.58
IN10
  Top 0.254: IC5.10 54.29,42.23 53.02,43.5 49.21,43.5 48.26,42.55 48.26,40.96 47.31,40.01 C29.2 45.09,40.01 45.09,43.5 44.45,44.13 23.81,44.13 22.23,45.72 IC9.8
IN11  (via drill 0.3)
  Top 0.254: IC3.10 36.51,42.23 35.24,43.5 31.43,43.5 30.48,42.55 30.48,40.96 29.53,40.01 C19.2 v27.3,40.01 | IC9.10 22.54,48.26 v23.18,47.62
  Bottom 0.254: v23.18,47.62 26.35,47.62 26.67,47.31 26.67,40.32 26.99,40.01 v27.3,40.01
IN12  (via drill 0.3)
  Top 0.254: IC3.5 36.51,35.24 35.24,33.97 31.43,33.97 30.48,34.92 30.48,36.51 29.53,37.47 C18.2 v27.3,37.47 | IC9.5 v22.86,41.91
  Bottom 0.254: v22.86,41.91 23.81,40.96 23.81,39.05 25.4,37.47 v27.3,37.47
IN13
  Top 0.254: IC5.5 54.29,35.24 53.02,33.97 49.21,33.97 48.26,34.92 48.26,36.51 47.31,37.47 C28.2 45.09,37.47 45.09,33.97 44.45,33.34 25.08,33.34 24.13,34.29 24.13,42.55 22.23,44.45 IC9.7
IN14  (via drill 0.3)
  Top 0.254: C17.2 28.57,35.24 v27.3,36.51 | v32.07,34.61 33.66,34.61 33.97,34.92 IC3.3 | IC9.4 v22.86,40.64
  Bottom 0.254: v32.07,34.61 30.16,36.51 v27.3,36.51 25.08,36.51 22.86,38.73 v22.86,40.64
IN15  (via drill 0.3)
  Top 0.254: IC5.3 51.75,34.92 51.44,34.61 v49.85,34.61 | 46.35,35.11 C27.2 46.99,34.74 v46.99,33.97 45.72,32.7 24.77,32.7 23.5,33.97 23.5,42.23 22.54,43.18 IC9.6
  Bottom 0.254: v49.85,34.61 49.85,34.92 48.26,36.51 45.09,36.51 45.09,35.88 v46.99,33.97
IN16  (via drill 0.3)
  Top 0.254: IC6.12 51.75,29.84 51.44,30.16 v49.85,30.16 | 46.35,29.66 C49.2 46.48,29.66 46.99,30.16 v46.99,30.8 45.72,32.07 18.41,32.07 v18.1,32.38 | IC10.21 12.7,20.32 v13.34,20.95
  Bottom 0.254: v49.85,30.16 47.94,28.26 45.09,28.26 45.09,28.89 v46.99,30.8 | v18.1,32.38 13.34,27.62 v13.34,20.95
IN17  (via drill 0.3)
  Top 0.254: IC4.12 33.97,29.84 33.66,30.16 v32.07,30.16 | v27.3,29.53 C40.2 | v14.92,25.08 12.7,22.86 IC10.19
  Bottom 0.254: v32.07,30.16 30.16,28.26 27.3,28.26 | v27.3,29.53 27.3,28.26 | 27.3,28.26 18.1,28.26 v14.92,25.08
IN18  (via drill 0.3)
  Top 0.254: IC6.10 54.29,29.53 53.02,30.8 48.9,30.8 48.26,30.16 48.26,28.26 47.31,27.3 C48.2 45.09,27.3 45.09,30.8 44.45,31.43 18.41,31.43 v18.1,31.11 | IC10.22 12.7,19.05 v13.97,20.32
  Bottom 0.254: v18.1,31.11 13.97,26.99 13.97,21.59 14.29,21.27 14.29,20.64 v13.97,20.32
IN19  (via drill 0.3)
  Top 0.254: IC4.10 36.51,29.53 35.24,30.8 31.43,30.8 30.48,29.84 30.48,28.26 29.53,27.3 C39.2 v27.3,27.3 | IC10.20 12.7,21.59 v14.92,23.81 13.34,22.23
  Bottom 0.254: v27.3,27.3 18.41,27.3 v14.92,23.81
IN20  (via drill 0.3)
  Top 0.254: IC4.5 36.51,22.54 35.24,21.27 31.43,21.27 30.48,22.23 30.48,23.81 29.53,24.77 C38.2 v27.3,24.77 | IC10.25 13.34,15.24 13.97,15.88 13.97,19.05 v14.92,20
  Bottom 0.254: v14.92,20 19.68,24.77 v27.3,24.77
IN21  (via drill 0.3)
  Top 0.254: IC6.5 54.29,22.54 53.02,21.27 48.9,21.27 48.26,21.91 48.26,23.81 47.31,24.77 C47.2 45.09,24.77 45.09,21.27 44.45,20.64 24.45,20.64 v24.13,20.95 | v13.34,17.78 IC10.23
  Bottom 0.254: v24.13,20.95 18.41,20.95 15.24,17.78 v13.34,17.78
IN22  (via drill 0.3)
  Top 0.254: IC4.3 33.97,22.23 33.66,21.91 v32.07,21.91 | v27.3,23.81 27.94,23.18 28.07,23.18 C37.2 | v14.92,18.73 14.92,15.56 13.34,13.97 IC10.26
  Bottom 0.254: v32.07,21.91 30.16,23.81 v27.3,23.81 20,23.81 v14.92,18.73
IN23  (via drill 0.3)
  Top 0.254: IC6.3 51.75,22.23 51.44,21.91 v49.85,21.91 | 46.35,22.41 C46.2 46.99,22.54 v46.99,21.27 45.72,20 v24.77,20 | v13.34,16.51 IC10.24
  Bottom 0.254: v49.85,21.91 47.94,23.81 45.09,23.81 45.09,23.18 v46.99,21.27 | v24.77,20 18.73,20 15.24,16.51 v13.34,16.51
IN24  (via drill 0.3)
  Top 0.254: IC8.12 51.75,17.14 51.44,17.46 v49.85,17.46 | 46.35,16.96 C67.2 46.99,16.83 v46.99,18.1 45.72,19.37 24.45,19.37 22.23,21.59 IC10.9
  Bottom 0.254: v49.85,17.46 47.94,15.56 45.09,15.56 45.09,16.19 v46.99,18.1
IN25  (via drill 0.3)
  Top 0.254: IC7.12 33.97,17.14 33.66,17.46 v32.07,17.46 | v27.3,16.83 C58.2 | IC10.11 22.54,24.13 v23.5,23.18
  Bottom 0.254: v32.07,17.46 30.16,15.56 27.3,15.56 v27.3,16.83 27.94,16.83 27.94,21.91 26.67,23.18 v23.5,23.18
IN26
  Top 0.254: IC8.10 54.29,16.83 53.02,18.1 48.9,18.1 48.26,17.46 48.26,15.56 47.31,14.61 C66.2 45.09,14.61 45.09,18.1 44.45,18.73 23.81,18.73 22.23,20.32 IC10.8
IN27  (via drill 0.3)
  Top 0.254: IC7.10 36.51,16.83 35.24,18.1 31.43,18.1 30.48,17.14 30.48,15.56 29.53,14.61 C57.2 v27.3,14.61 | IC10.10 22.54,22.86 v23.18,22.23
  Bottom 0.254: v23.18,22.23 26.04,22.23 26.67,21.59 26.67,15.24 v27.3,14.61
IN28  (via drill 0.3)
  Top 0.254: IC7.5 36.51,9.84 35.24,8.57 31.43,8.57 30.48,9.53 30.48,11.11 29.53,12.06 C56.2 v27.3,12.06 | IC10.5 v22.86,16.51
  Bottom 0.254: v22.86,16.51 23.81,15.56 23.81,13.34 25.08,12.06 v27.3,12.06
IN29
  Top 0.254: IC8.5 54.29,9.84 53.02,8.57 48.9,8.57 48.26,9.21 48.26,11.11 47.31,12.06 C65.2 45.09,12.06 45.09,8.57 44.45,7.94 25.08,7.94 24.13,8.89 24.13,17.14 22.23,19.05 IC10.7
IN30  (via drill 0.3)
  Top 0.254: C55.2 28.57,9.84 v27.3,11.11 | v32.07,9.21 33.66,9.21 33.97,9.53 IC7.3 | IC10.4 v22.86,15.24
  Bottom 0.254: v32.07,9.21 30.16,11.11 v27.3,11.11 24.77,11.11 22.86,13.02 v22.86,15.24
IN31  (via drill 0.3)
  Top 0.254: IC8.3 51.75,9.53 51.44,9.21 v49.85,9.21 | 46.35,9.71 C64.2 46.99,9.84 v46.99,8.57 45.72,7.3 24.77,7.3 23.5,8.57 23.5,16.83 22.54,17.78 IC10.6
  Bottom 0.254: v49.85,9.21 47.94,11.11 45.09,11.11 45.09,10.48 v46.99,8.57
MUX2-DAC
  Top 0.254: IC10.28 10.16,11.43 8.89,12.7 8.89,21.27 6.35,23.81 SV3.2
MUX2-EN
  Top 0.254: IC10.18 9.84,24.13 6.67,27.3 6.67,32.07 4.76,33.97 SV2.2
N$1  (via drill 0.3)
  Top 0.254: IC1.2 32.7,50.16 33.02,50.48 v34.61,50.48
  Bottom 0.254: v34.61,50.48 33.66,50.48 33.55,50.38 C33.2 33.76,49.96 R2.1
N$2  (via drill 0.3)
  Top 0.254: IC1.1 31.43,49.53 v30.8,50.16
  Bottom 0.254: C33.1 v30.8,50.16 29,50.16 R1.1
N$3  (via drill 0.3)
  Top 0.254: IC1.7 39.05,49.53 v39.69,50.16
  Bottom 0.254: R3.1 40.54,50.16 v39.69,50.16 C34.1
N$4  (via drill 0.3)
  Top 0.254: IC1.8 39.05,53.34 v39.69,52.7
  Bottom 0.254: 41.06,52.81 R5.1 40.85,52.7 v39.69,52.7 C5.1
N$5  (via drill 0.3)
  Top 0.254: IC1.6 37.78,50.16 37.47,50.48 v35.88,50.48
  Bottom 0.254: R4.1 C34.2 36.62,50.48 v35.88,50.48
N$6  (via drill 0.3)
  Top 0.254: v30.8,52.7 31.43,53.34 IC1.14
  Bottom 0.254: C6.1 v30.8,52.7 28.89,52.7 R8.1
N$7  (via drill 0.3)
  Top 0.254: IC1.9 37.78,52.7 37.47,52.39 v35.88,52.39
  Bottom 0.254: R6.1 C5.2 37.25,52.39 v35.88,52.39
N$8  (via drill 0.3)
  Top 0.254: v34.61,52.39 33.02,52.39 32.7,52.7 IC1.13
  Bottom 0.254: C6.2 33.66,52.39 | 33.66,52.39 v34.61,52.39 | R7.1 33.76,52.49 33.66,52.39
N$9  (via drill 0.3)
  Top 0.254: IC3.1 31.43,36.83 v30.8,37.47
  Bottom 0.254: R17.1 29.63,37.47 v30.8,37.47 C21.1
N$10  (via drill 0.3)
  Top 0.254: IC3.2 32.7,37.47 33.02,37.78 v34.61,37.78
  Bottom 0.254: R18.1 33.44,34.92 33.34,34.92 33.55,35.14 C21.2 33.87,37.78 v34.61,37.78
N$11  (via drill 0.3)
  Top 0.254: IC2.1 49.21,49.53 v48.58,50.16
  Bottom 0.254: R9.1 46.77,50.16 v48.58,50.16 C12.1
N$12  (via drill 0.3)
  Top 0.254: IC2.2 50.48,50.16 50.8,50.48 v52.39,50.48
  Bottom 0.254: v52.39,50.48 51.65,50.48 C12.2 51.54,49.96 R10.1
N$13  (via drill 0.3)
  Top 0.254: IC2.7 56.83,49.53 v57.47,50.16
  Bottom 0.254: R11.1 58.32,50.16 v57.47,50.16 C13.1
N$14  (via drill 0.3)
  Top 0.254: IC2.6 55.56,50.16 55.24,50.48 v53.66,50.48
  Bottom 0.254: v53.66,50.48 54.4,50.48 C13.2 R12.1
N$15  (via drill 0.3)
  Top 0.254: IC2.8 56.83,53.34 v57.47,52.7
  Bottom 0.254: R13.1 58.32,52.7 v57.47,52.7 C14.1
N$16  (via drill 0.3)
  Top 0.254: IC2.14 49.21,53.34 v48.58,52.7
  Bottom 0.254: R16.1 46.77,52.7 v48.58,52.7 C15.1
N$17  (via drill 0.3)
  Top 0.254: IC2.9 55.56,52.7 55.24,52.39 v53.66,52.39
  Bottom 0.254: v53.66,52.39 54.4,52.39 C14.2 R14.1
N$18  (via drill 0.3)
  Top 0.254: IC2.13 50.48,52.7 50.8,52.39 v52.39,52.39
  Bottom 0.254: R15.1 51.33,54.72 C15.2 51.65,52.39 v52.39,52.39
N$19  (via drill 0.3)
  Top 0.254: IC3.7 39.05,36.83 v39.69,37.47
  Bottom 0.254: R19.1 40.54,37.47 v39.69,37.47 C22.1
N$20  (via drill 0.3)
  Top 0.254: IC3.6 37.78,37.47 37.47,37.78 v35.88,37.78
  Bottom 0.254: v35.88,37.78 36.62,37.78 C22.2 R20.1
N$21  (via drill 0.3)
  Top 0.254: IC3.8 39.05,40.64 v39.69,40.01
  Bottom 0.254: R21.1 40.54,40.01 v39.69,40.01 C23.1
N$22  (via drill 0.3)
  Top 0.254: IC3.14 31.43,40.64 v30.8,40.01
  Bottom 0.254: R24.1 29.63,40.01 v30.8,40.01 C24.1
N$23  (via drill 0.3)
  Top 0.254: IC3.9 37.78,40.01 37.47,39.69 v35.88,39.69
  Bottom 0.254: v35.88,39.69 36.62,39.69 C23.2 R22.1
N$24  (via drill 0.3)
  Top 0.254: IC3.13 32.7,40.01 33.02,39.69 v34.61,39.69
  Bottom 0.254: v34.61,39.69 33.87,39.69 C24.2 33.55,40.22 33.66,40.32 33.66,41.81 R23.1
N$25  (via drill 0.3)
  Top 0.254: IC5.1 49.21,36.83 v48.58,37.47
  Bottom 0.254: R25.1 47.41,37.47 v48.58,37.47 C31.1
N$26  (via drill 0.3)
  Top 0.254: IC5.2 50.48,37.47 50.8,37.78 v52.39,37.78
  Bottom 0.254: v52.39,37.78 51.65,37.78 C31.2 51.54,37.26 R26.1
N$27  (via drill 0.3)
  Top 0.254: IC5.7 56.83,36.83 v57.47,37.47
  Bottom 0.254: R27.1 58.32,37.47 v57.47,37.47 C32.1
N$28  (via drill 0.3)
  Top 0.254: IC5.6 55.56,37.47 55.24,37.78 v53.66,37.78
  Bottom 0.254: R28.1 C32.2 54.4,37.78 v53.66,37.78
N$29  (via drill 0.3)
  Top 0.254: IC5.8 56.83,40.74 v57.47,40.11
  Bottom 0.254: C35.1 56.52,40.11 v57.47,40.11 58.42,40.01 R29.1
N$30  (via drill 0.3)
  Top 0.254: IC5.14 49.21,40.64 v48.58,40.01
  Bottom 0.254: R32.1 47.41,40.01 v48.58,40.01 C36.1
N$31  (via drill 0.3)
  Top 0.254: IC5.9 55.56,40.01 55.24,39.69 v53.66,39.69
  Bottom 0.254: R30.1 C35.2 54.4,39.69 v53.66,39.69
N$32  (via drill 0.3)
  Top 0.254: IC5.13 50.48,40.01 50.8,39.69 v52.39,39.69
  Bottom 0.254: v52.39,39.69 51.65,39.69 C36.2 51.54,40.21 R31.1
N$33  (via drill 0.3)
  Top 0.254: IC4.1 31.43,24.13 v30.8,24.77
  Bottom 0.254: R33.1 29.63,24.77 v30.8,24.77 C41.1
N$34  (via drill 0.3)
  Top 0.254: IC4.2 32.7,24.77 33.02,25.08 v34.61,25.08
  Bottom 0.254: v34.61,25.08 33.87,25.08 C41.2 33.76,24.56 R34.1
N$35  (via drill 0.3)
  Top 0.254: IC4.7 39.05,24.13 v39.69,24.77
  Bottom 0.254: R35.1 40.54,24.77 v39.69,24.77 C42.1
N$36  (via drill 0.3)
  Top 0.254: IC4.6 37.78,24.77 37.47,25.08 v35.88,25.08
  Bottom 0.254: v35.88,25.08 36.62,25.08 C42.2 R36.1
N$37  (via drill 0.3)
  Top 0.254: IC4.8 39.05,27.94 v39.69,27.3
  Bottom 0.254: R37.1 40.54,27.3 v39.69,27.3 C43.1
N$38  (via drill 0.3)
  Top 0.254: IC4.14 31.43,27.94 v30.8,27.3
  Bottom 0.254: R40.1 29.63,27.3 v30.8,27.3 C44.1
N$39  (via drill 0.3)
  Top 0.254: IC4.9 37.78,27.3 37.47,26.99 v35.88,26.99
  Bottom 0.254: v35.88,26.99 36.62,26.99 C43.2 R38.1
N$40  (via drill 0.3)
  Top 0.254: IC4.13 32.7,27.3 33.02,26.99 v34.61,26.99
  Bottom 0.254: v34.61,26.99 33.87,26.99 C44.2 33.76,27.51 R39.1
N$41  (via drill 0.3)
  Top 0.254: IC6.1 49.21,24.13 v48.58,24.77
  Bottom 0.254: R41.1 47.41,24.77 v48.58,24.77 C50.1
N$42  (via drill 0.3)
  Top 0.254: IC6.2 50.48,24.77 50.8,25.08 v52.39,25.08
  Bottom 0.254: v52.39,25.08 51.65,25.08 C50.2 51.54,24.56 R42.1
N$43  (via drill 0.3)
  Top 0.254: IC6.7 56.83,24.13 v57.47,24.77
  Bottom 0.254: C51.1 v57.47,24.77 58.32,24.77 R43.1
N$44  (via drill 0.3)
  Top 0.254: IC6.6 55.56,24.77 55.24,25.08 v53.66,25.08
  Bottom 0.254: v53.66,25.08 54.4,25.08 C51.2 R44.1
N$45  (via drill 0.3)
  Top 0.254: IC6.8 56.83,27.94 v57.47,27.3
  Bottom 0.254: R45.1 58.32,27.3 v57.47,27.3 C52.1
N$46  (via drill 0.3)
  Top 0.254: IC6.14 49.21,27.94 v48.58,27.3
  Bottom 0.254: R48.1 47.41,27.3 v48.58,27.3 C53.1
N$47  (via drill 0.3)
  Top 0.254: IC6.9 55.56,27.3 55.24,26.99 v53.66,26.99
  Bottom 0.254: v53.66,26.99 54.4,26.99 C52.2 R46.1
N$48  (via drill 0.3)
  Top 0.254: IC6.13 50.48,27.3 50.8,26.99 v52.39,26.99
  Bottom 0.254: v52.39,26.99 51.65,26.99 C53.2 51.54,27.51 R47.1
N$49  (via drill 0.3)
  Top 0.254: IC7.1 31.43,11.43 v30.8,12.06
  Bottom 0.254: R49.1 29.63,12.06 v30.8,12.06 C59.1
N$50  (via drill 0.3)
  Top 0.254: IC7.2 32.7,12.06 33.02,12.38 v34.61,12.38
  Bottom 0.254: v34.61,12.38 33.87,12.38 C59.2 33.76,11.86 R50.1
N$51  (via drill 0.3)
  Top 0.254: IC7.7 39.05,11.43 v39.69,12.06
  Bottom 0.254: R51.1 40.54,12.06 v39.69,12.06 C60.1
N$52  (via drill 0.3)
  Top 0.254: IC7.6 37.78,12.06 37.47,12.38 v35.88,12.38
  Bottom 0.254: R52.1 C60.2 36.62,12.38 v35.88,12.38
N$53  (via drill 0.3)
  Top 0.254: IC7.8 39.05,15.24 v39.69,14.61
  Bottom 0.254: R53.1 40.54,14.61 v39.69,14.61 C61.1
N$54  (via drill 0.3)
  Top 0.254: IC7.14 31.43,15.24 v30.8,14.61
  Bottom 0.254: R56.1 29.63,14.61 v30.8,14.61 C62.1
N$55  (via drill 0.3)
  Top 0.254: IC7.9 37.78,14.61 37.47,14.29 v35.88,14.29
  Bottom 0.254: v35.88,14.29 36.62,14.29 C61.2 R54.1
N$56  (via drill 0.3)
  Top 0.254: IC7.13 32.7,14.61 33.02,14.29 v34.61,14.29
  Bottom 0.254: v34.61,14.29 33.87,14.29 C62.2 33.76,14.81 R55.1
N$57  (via drill 0.3)
  Top 0.254: IC8.1 49.21,11.43 v48.58,12.06
  Bottom 0.254: R57.1 47.41,12.06 v48.58,12.06 C68.1
N$58  (via drill 0.3)
  Top 0.254: IC8.2 50.48,12.06 50.8,12.38 v52.39,12.38
  Bottom 0.254: R58.1 51.54,11.86 C68.2 51.65,12.38 v52.39,12.38
N$59  (via drill 0.3)
  Top 0.254: IC8.7 56.83,11.43 v57.47,12.06
  Bottom 0.254: R59.1 58.32,12.06 v57.47,12.06 C69.1
N$60  (via drill 0.3)
  Top 0.254: IC8.6 55.56,12.06 55.24,12.38 v53.66,12.38
  Bottom 0.254: R60.1 C69.2 54.4,12.38 v53.66,12.38
N$61  (via drill 0.3)
  Top 0.254: IC8.8 56.83,15.24 v57.47,14.61
  Bottom 0.254: R61.1 58.32,14.61 v57.47,14.61 C70.1
N$62  (via drill 0.3)
  Top 0.254: IC8.14 49.21,15.24 v48.58,14.61
  Bottom 0.254: R64.1 47.41,14.61 v48.58,14.61 C71.1
N$63  (via drill 0.3)
  Top 0.254: IC8.9 55.56,14.61 55.24,14.29 v53.66,14.29
  Bottom 0.254: R62.1 C70.2 54.4,14.29 v53.66,14.29
N$64  (via drill 0.3)
  Top 0.254: IC8.13 50.48,14.61 50.8,14.29 v52.39,14.29
  Bottom 0.254: v52.39,14.29 51.65,14.29 C71.2 51.54,14.81 R63.1
OUT0
  Bottom 0.254: R8.2 29.74,54.51 31.43,56.2 35.56,56.2 | 35.56,56.2 40.96,56.2 41.91,55.24 44.13,55.24 46.35,57.47 59.37,57.47 62.23,54.61 SV1.1 | R7.2 35.46,56.09 35.56,56.2
OUT1
  Bottom 0.254: R6.2 39.05,54.51 R5.2 44.35,54.51 46.67,56.83 59.05,56.83 60.96,54.93 60.96,50.8 61.59,50.16 63.5,50.16 SV1.2
OUT2
  Bottom 0.254: R16.2 47.52,54.51 49.21,56.2 53.34,56.2 | 53.34,56.2 58.74,56.2 60.33,54.61 60.33,50.48 SV1.3 | R15.2 53.24,56.09 53.34,56.2
OUT3
  Bottom 0.254: R13.2 56.83,54.51 R14.2 | R13.2 58.42,54.61 | R13.2 58.42,54.29 59.69,54.29 59.69,49.53 61.59,47.62 63.5,47.62 SV1.4
OUT4
  Bottom 0.254: R12.2 56.83,48.36 R11.2 58.63,48.58 59.69,48.58 61.91,46.35 SV1.5
OUT5
  Bottom 0.254: R9.2 47.52,48.36 49.21,46.67 53.34,46.67 | 53.34,46.67 60.01,46.67 61.59,45.09 63.5,45.09 SV1.6 | R10.2 53.24,46.77 53.34,46.67
OUT6
  Bottom 0.254: R4.2 39.05,48.36 R3.2 44.35,48.36 46.67,46.04 59.69,46.04 61.91,43.81 SV1.7
OUT7
  Bottom 0.254: R1.2 29.74,48.36 31.43,46.67 35.56,46.67 | 35.56,46.67 40.96,46.67 41.91,47.62 44.13,47.62 46.35,45.4 59.05,45.4 61.91,42.55 63.5,42.55 SV1.8 | R2.2 35.46,46.77 35.56,46.67
OUT8
  Bottom 0.254: R24.2 29.74,41.81 31.43,43.5 35.56,43.5 | 35.56,43.5 40.96,43.5 41.91,42.55 44.13,42.55 46.35,44.77 58.74,44.77 61.91,41.59 61.91,41.27 SV1.9 | R23.2 35.46,43.4 35.56,43.5
OUT9
  Bottom 0.254: R22.2 39.05,41.81 R21.2 44.35,41.81 46.67,44.13 58.42,44.13 60.96,41.59 60.96,40.64 61.59,40.01 63.5,40.01 SV1.10
OUT10
  Bottom 0.254: R32.2 47.2,41.49 49.21,43.5 53.34,43.5 | 53.34,43.5 58.1,43.5 60.33,41.27 60.33,40.32 61.91,38.73 62.23,39.05 SV1.11 | 53.34,43.5 53.34,42.33 R31.2
OUT11
  Bottom 0.254: R30.2 56.83,41.81 58.1,41.81 R29.2 59.69,40.32 59.69,39.37 61.59,37.47 63.5,37.47 SV1.12
OUT12
  Bottom 0.254: R28.2 56.83,35.66 R27.2 58.95,36.2 SV1.13
OUT13
  Bottom 0.254: R25.2 47.52,35.66 49.21,33.97 53.34,33.97 | 53.34,33.97 60.64,33.97 61.59,34.92 63.5,34.92 SV1.14 | 53.34,33.97 53.34,35.14 R26.2
OUT14
  Bottom 0.254: R20.2 39.05,35.66 R19.2 44.35,35.66 46.67,33.34 61.59,33.34 61.91,33.66 SV1.15
OUT15
  Bottom 0.254: R17.2 29.74,35.66 31.43,33.97 35.56,33.97 | 35.56,33.97 40.96,33.97 41.91,34.92 44.13,34.92 46.35,32.7 61.28,32.7 61.59,32.38 63.5,32.38 SV1.16 | R18.2 35.46,34.08 35.56,33.97
OUT16
  Bottom 0.254: R40.2 29.74,29.11 31.43,30.8 35.56,30.8 | 35.56,30.8 40.96,30.8 41.91,29.84 44.13,29.84 46.35,32.07 61.28,32.07 SV1.17 | 35.56,30.8 35.56,29.63 R39.2
OUT17
  Bottom 0.254: R38.2 39.05,29.11 R37.2 44.35,29.11 46.67,31.43 60.01,31.43 61.59,29.84 63.5,29.84 SV1.18
OUT18
  Bottom 0.254: R48.2 47.31,29.21 48.9,30.8 53.34,30.8 | 53.34,30.8 59.69,30.8 61.91,28.57 SV1.19 | 53.34,30.8 53.34,29.63 R47.2
OUT19
  Bottom 0.254: R46.2 56.83,29.11 R45.2 59.79,29.11 61.59,27.3 63.5,27.3 SV1.20
OUT20
  Bottom 0.254: R44.2 56.83,22.96 R43.2 58.84,22.96 61.91,26.04 SV1.21
OUT21
  Bottom 0.254: R41.2 47.31,22.86 48.9,21.27 53.34,21.27 | 53.34,21.27 58.42,21.27 60.96,23.81 60.96,24.13 61.59,24.77 63.5,24.77 SV1.22 | R42.2 53.24,21.38 53.34,21.27
OUT22
  Bottom 0.254: R36.2 39.05,22.96 R35.2 44.35,22.96 46.67,20.64 59.05,20.64 61.91,23.5 SV1.23
OUT23
  Bottom 0.254: R33.2 29.74,22.96 31.43,21.27 35.56,21.27 | 35.56,21.27 40.96,21.27 41.91,22.23 44.13,22.23 46.35,20 59.37,20 61.59,22.23 63.5,22.23 SV1.24 | 35.56,21.27 35.56,22.44 R34.2
OUT24
  Bottom 0.254: R56.2 29.74,16.41 31.43,18.1 35.56,18.1 | 35.56,18.1 40.96,18.1 41.91,17.14 44.13,17.14 46.35,19.37 60.33,19.37 61.91,20.95 SV1.25 | 35.56,18.1 35.56,16.93 R55.2
OUT25
  Bottom 0.254: R54.2 39.05,16.41 R53.2 40.64,16.51 44.45,16.51 46.67,18.73 60.64,18.73 61.59,19.68 63.5,19.68 SV1.26
OUT26
  Bottom 0.254: R64.2 47.31,16.51 48.9,18.1 53.34,18.1 | 53.34,18.1 61.91,18.1 SV1.27 | 53.34,18.1 53.34,16.93 R63.2
OUT27
  Bottom 0.254: R62.2 56.83,16.41 R61.2 58.95,16.41 59.69,17.14 63.5,17.14 SV1.28
OUT28
  Bottom 0.254: R60.2 56.83,10.26 R59.2 58.84,10.26 59.69,11.11 59.69,14.92 60.64,15.88 SV1.29
OUT29
  Bottom 0.254: R57.2 47.31,10.16 48.9,8.57 53.34,8.57 | 53.34,8.57 58.74,8.57 60.33,10.16 60.33,13.34 61.59,14.61 63.5,14.61 SV1.30 | 53.34,8.57 53.34,9.74 R58.2
OUT30
  Bottom 0.254: R52.2 39.05,10.26 R51.2 44.35,10.26 46.67,7.94 59.05,7.94 60.96,9.84 60.96,12.38 61.91,13.34 SV1.31
OUT31
  Bottom 0.254: R49.2 29.74,10.26 31.43,8.57 35.56,8.57 | 35.56,8.57 40.96,8.57 41.91,9.53 44.13,9.53 46.35,7.3 59.37,7.3 61.59,9.53 63.5,9.53 63.5,12.06 SV1.32 | 35.56,8.57 35.56,9.74 R50.2
V+
  Top 0.406: SV1.33 57.78,6.35 41.27,6.35 40.01,5.08 40.01,1.91 39.37,1.27 38.1,1.27 36.2,3.17 J1.1
  Bottom 0.406: R65.2 36.2,5.4 J1.1
V-
  Top 0.406: J1.3 57.47,3.49 SV1.35
  Bottom 0.406: R66.2 31.75,1.27 41.27,1.27 J1.3

### Text on the board
tPlace: Shared | Mux enable | Distinct | Shared | DAC in | Distinct